# Altium project power_distribution.PrjPcb
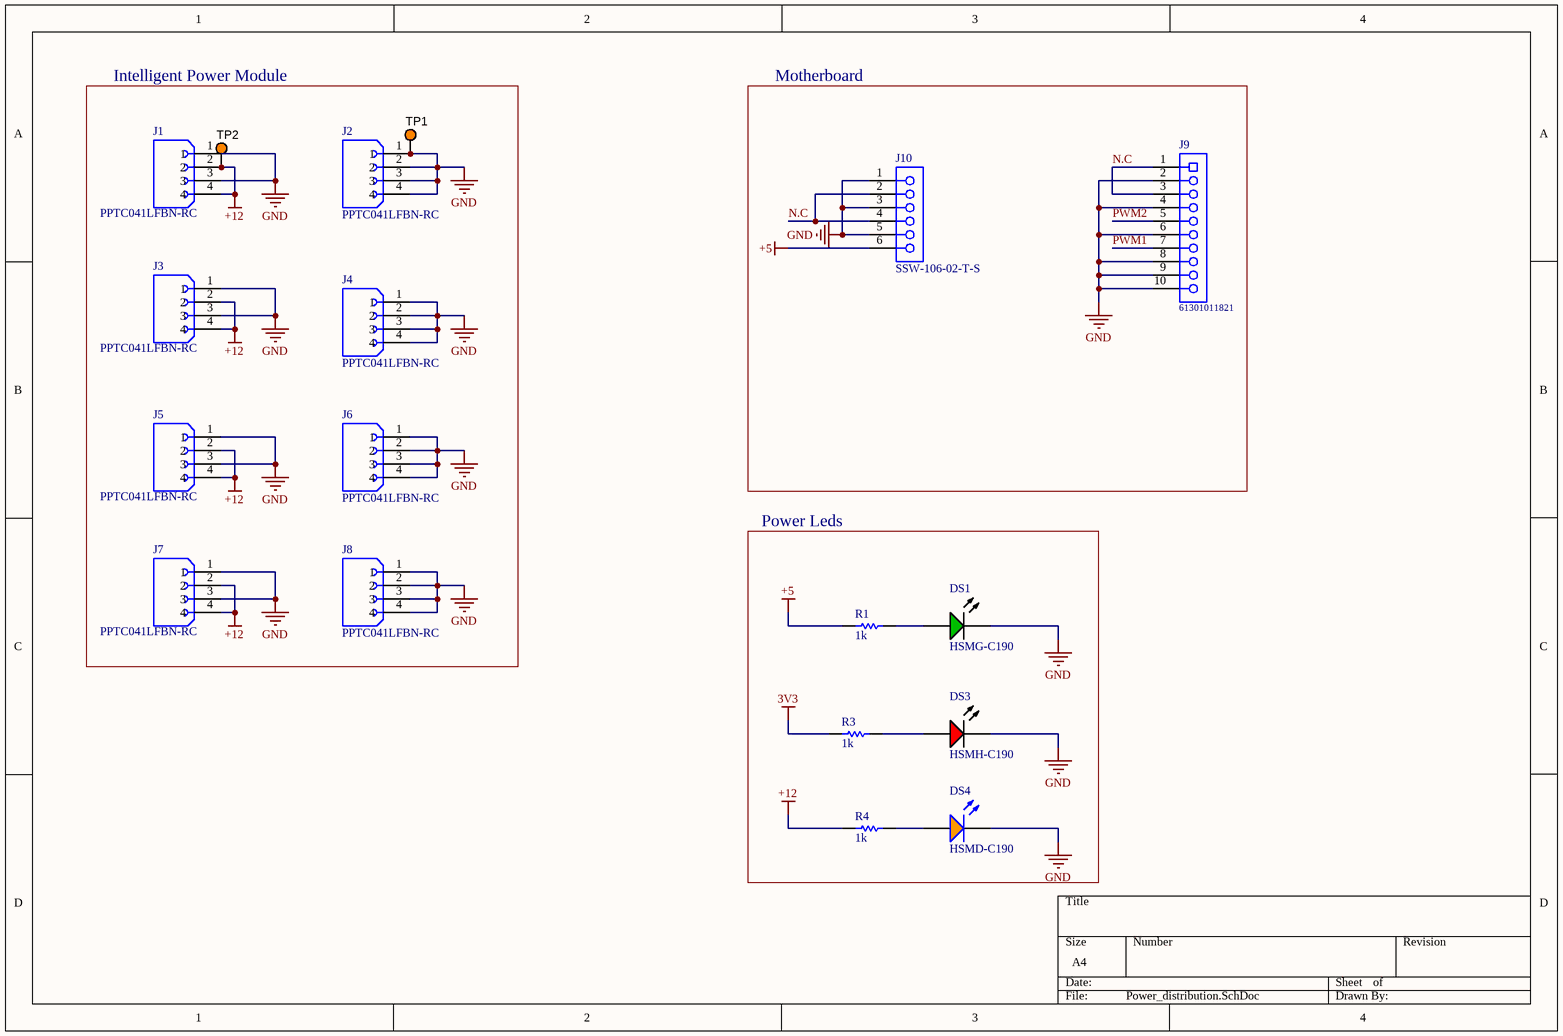
[diagram p0: Power_distribution.SchDoc]
2 sheets, 43 parts. Net scope: global (net labels, ports and power ports of the same name join across sheets).
Board file: Power_distribution.PcbDoc
Sheets:
  Power_distribution.SchDoc
  Power_distribution2.SchDoc

## Sheet Power_distribution.SchDoc
size A4; SheetNumber: 1; SheetTotal: 2

### Parts
DS1  HSMG-C190  [AVAG-HSMX-C190_V]
DS3  HSMH-C190  [AVAG-HSMX-C190_V]
DS4  HSMD-C190  [AVAG-HSMX-C190_V]
J1  PPTC041LFBN-RC  [SULLINS_PPTC041LFBN-RC]
J2  PPTC041LFBN-RC  [SULLINS_PPTC041LFBN-RC]
J3  PPTC041LFBN-RC  [SULLINS_PPTC041LFBN-RC]
J4  PPTC041LFBN-RC  [SULLINS_PPTC041LFBN-RC]
J5  PPTC041LFBN-RC  [SULLINS_PPTC041LFBN-RC]
J6  PPTC041LFBN-RC  [SULLINS_PPTC041LFBN-RC]
J7  PPTC041LFBN-RC  [SULLINS_PPTC041LFBN-RC]
J8  PPTC041LFBN-RC  [SULLINS_PPTC041LFBN-RC]
J9  61301011821  [61301011821]
J10  SSW-106-02-T-S  [SMTC-SSW-106-02-X-S]
R1  1k  [RESC1609X50X30NL8T20]
R3  1k  [RESC1609X50X30NL8T20]
R4  1k  [RESC1609X50X30NL8T20]
TP1  5003  [KSTN-5003]  (value not drawn)
TP2  5003  [KSTN-5003]  (value not drawn)

### Blocks framed on the sheet
Intelligent Power Module: J1-J8 TP1 TP2
Motherboard: J9 J10
Power Leds: DS1 DS3 DS4 R1 R3 R4

### Nets
3V3: R3.1
+5: J10.6 R1.1
+12: J1.2 J1.4 J3.2 J3.4 J5.2 J5.4 J7.2 J7.4 R4.1 TP2.1
GND: DS1.2(K) DS3.2(K) DS4.2(K) J1.1 J1.3 J2.1 J2.2 J2.3 J2.4 J3.1 J3.3 J4.1 J4.2 J4.3 J4.4 J5.1 J5.3 J6.1 J6.2 J6.3 J6.4 J7.1 J7.3 J8.1 J8.2 J8.3 J8.4 J9.2 J9.4 J9.6 J9.8 J9.9 J9.10 J10.1 J10.3 J10.5 TP1.1
N.C: J9.1 J9.3 J10.2 J10.4
PWM1: J9.7
PWM2: J9.5
NetDS1_1: DS1.1(A) R1.2
NetDS3_1: DS3.1(A) R3.2
NetDS4_1: DS4.1(A) R4.2

### Library data of the parts
DS1 = CMP-1744-00002-1: Chip LED, Green, 2.2 V, -40 to 85 degC, 2-Pin SMD, RoHS, Tape and Reel; Frequency: 400 KHz; Max Supply Voltage: 5.5 V; Access Time: 3500 ns; Clock Frequency: 100 KHz; Case\Package: SOIC; Density: 32 kb; Nominal Supply Current: 2 mA; Interface: Serial; Min Supply Voltage: 1.7 V; Packaging: Tape and Reel; PackageReference: HSMX-C190; ComponentLink2URL: http://docs.avagotech.com/docs/AV02-0551EN; RoHSCompliant: true; Pins: 8; REACH SVHC: No SVHC; Max Operating Temperature: 85 degC; Width: 4 mm; Radiation Hardening: No; Package Quantity: 3000; ComponentLink3Description: Package Specification; ComponentLink1Description: Manufacturer URL; Min Operating Temperature: -40 degC; PackageDescription: 2-Pin Surface Mount Device, Body 1.6 x 0.8 mm, Height 0.9 mm; Max Clock Frequency: 100 KHz; Height: 1.5 mm; ComponentLink1URL: http://www.avagotech.com/; DatasheetVersion: Mar-12; ComponentLink2Description: Datasheet; Mount: Surface Mount; Length: 5 mm; ComponentLink3URL: http://www.fairchildsemi.com/dwg/MA/MA03D.pdf
DS3 = CMP-1744-00004-1: LED Uni-Color Red, 65 mW, 20 mA, -40 to 85 degC, 2-Pin SMD, RoHS, Tape and Reel; Connector Type: USB; Gender: Male; Current Rating: 1 A; Length: 7.5 mm; Lead Pitch: 0.65 mm; PackageReference: HSMX-C190; Package Quantity: 2000; Max Operating Temperature: 85 degC; PackageDescription: 2-Pin Surface Mount Device, Body 1.6 x 0.8 mm, Height 0.9 mm; ComponentLink3Description: Package Specification; Mount: Surface Mount; Min Operating Temperature: -30 degC; ComponentLink3URL: http://www.fairchildsemi.com/dwg/MA/MA03D.pdf; ComponentLink1Description: Manufacturer URL; Contact Material: Copper; Pins: 5; Width: 5.6 mm; ComponentLink2Description: Datasheet; RoHSCompliant: true; DatasheetVersion: Mar-12; Height: 2.8 mm; Packaging: Tape and Reel; Contact Plating: Gold; ComponentLink1URL: http://www.avagotech.com/; REACH SVHC: No SVHC; ComponentLink2URL: http://docs.avagotech.com/docs/AV02-0551EN
DS4 = CMP-1744-00006-1: LED Uni-Color Orange, 52 mW, 20 mA, -40 to 85 degC, 2-Pin SMD, RoHS, Tape and Reel; ComponentLink2Description: Datasheet; RoHSCompliant: True; ComponentLink3URL: http://www.fairchildsemi.com/dwg/MA/MA03D.pdf; Package Quantity: 100; Max Operating Temperature: 225degC; Min Operating Temperature: -40degC; ComponentLink2URL: http://docs.avagotech.com/docs/AV02-0551EN; PackageDescription: 2-Pin Surface Mount Device, Body 1.6 x 0.8 mm, Height 0.9 mm; DatasheetVersion: Mar-12; PackageReference: HSMX-C190; ComponentLink1URL: http://www.avagotech.com/; ComponentLink3Description: Package Specification; ComponentLink1Description: Manufacturer URL
J1-J8 = PPTC041LFBN-RC: 4 Position Header Connector Through Hole; MF: Sullins Connector; MP: PPTC041LFBN-RC; Value: *; SnapEDA_Link: https://www.snapeda.com/parts/PPTC041LFBN-RC/Sullins%20Connector%20Solutions/view-part/285917/?ref=snap; Package: None; Availability: Warning; Check_prices: https://www.snapeda.com/parts/PPTC041LFBN-RC/Sullins%20Connector%20Solutions/view-part/285917/?ref=eda; Price: None; Purchase-URL: https://pricing.snapeda.com/search/part/PPTC041LFBN-RC/?ref=eda
J9 = CMP-1502-01332-1: THT Vertical Socket Header WR-PHD, Pitch 2.54 mm, Single Row, 10 pins; Manufacturer: Wurth Elektronik; Rated Current: 3A; Working Voltage: 250VAC; Gender: Female; Pitch: 2.54mm; Contact Resistance: 20mOhm; Pin Number: 10; Withstanding Voltage: 500VAC; Publisher: WurthElektronik; Orientation: Vertical; Row Number: Single; Package Reference: 61301011821; Packaging: Tray; Datasheet URL: https://katalog.we-online.de/em/datasheet/6130xx11821.pdf; Operating Temperature: -40to125degC; Part Number: 61301011821; Manufacturer URL: http://www.we-online.de; Mounting Technology: THT
J10 = CMP-1023-00360-1: SQ Post Socket, Through-hole, Vertical, -55 to 105 degC, 2.54mm Pitch, 6-Pin, Female, RoHS; Manufacturer: Samtec; ComponentLink1URL: http://www.samtec.com; Temperature Range: -55 to 105 degC; Pitch: 2.54 mm; Mounting Technology: Through-hole; DatasheetVersion: F-214; ComponentLink1Description: Manufacturer URL; PackageVersion: CA, 6/1987; ComponentLink3Description: Package Specification; PackageDescription: Assembly, Socket Strip .016 X .031 Tail; ComponentLink2Description: Datasheet; ComponentLink2URL: http://www.samtec.com/documents/webfiles/pdf/SSW_TH.PDF; PackageReference: SSW-106-02-X-S; ComponentLink3URL: http://www.samtec.com/documents/webfiles/cpdf/SSW-1XX-XX-XXX-X-XX-XXX-XX-MKT.pdf; RoHS: True; PartNumber: SSW-106-02-T-S; Orientation: Vertical
R1 R3 R4 = CMP-2000-03816-5: Chip Resistor, 0 Ohm, Jumper, 100 mW, -55 to 155 degC, 0603 (1608 Metric), RoHS, Tape and Reel; Manufacturer: Vishay Semiconductor; Voltage Rating: 75 V; Package Quantity: 5000; DatasheetVersion: 06/2012; Min Operating Temperature: -55 degC; ComponentLink1URL: http://www.vishay.com/; Mounting Technology: Surface Mount; Height: 0.45 mm; ComponentLink1Description: Manufacturer URL; REACH SVHC: Unknown; PackageReference: 0603; Packaging: Tape and Reel; Max Operating Temperature: 155 degC; Mount: Surface Mount; ComponentLink2Description: Datasheet; PackageDescription: 2-Pin Surface Mount Device, Body 1.575 x 0.85 mm; Length: 1.55 mm; ComponentLink2URL: http://www.vishay.com/docs/20035/dcrcwe3.pdf; Pins: 2; RoHSCompliant: true
TP1 TP2 = CMP-1672-00009-1: Test Point, Orange, 1-Pin THD, RoHS; Peak Reverse Current: 600 uA; Forward Current: 3 A; Max Surge Current: 80 A; Forward Voltage: 1.08 V; Max Operating Temperature: 150 degC; PackageReference: 5003; Pins: 2; ComponentLink2URL: http://keyelco.com/userAssets/file/M65p56.pdf; PackageDescription: 1-Pin Through Hole Device, Dia 2.54 mm; Weight: 0.01 lb; Diameter: 5.3 mm; Mount: Through Hole; Package Quantity: 500; Packaging: Bulk; Min Operating Temperature: -65 degC; ComponentLink1Description: Manufacturer URL; Height: 0.25 inch; ComponentLink1URL: http://www.keyelco.com/; ComponentLink2Description: Datasheet; Width: 0.25 inch; REACH SVHC: No SVHC; RoHSCompliant: true; Radiation Hardening: No; Length: 9.5 mm; DatasheetVersion: Jun-15

## Sheet Power_distribution2.SchDoc
size A4; SheetNumber: 2; SheetTotal: 2
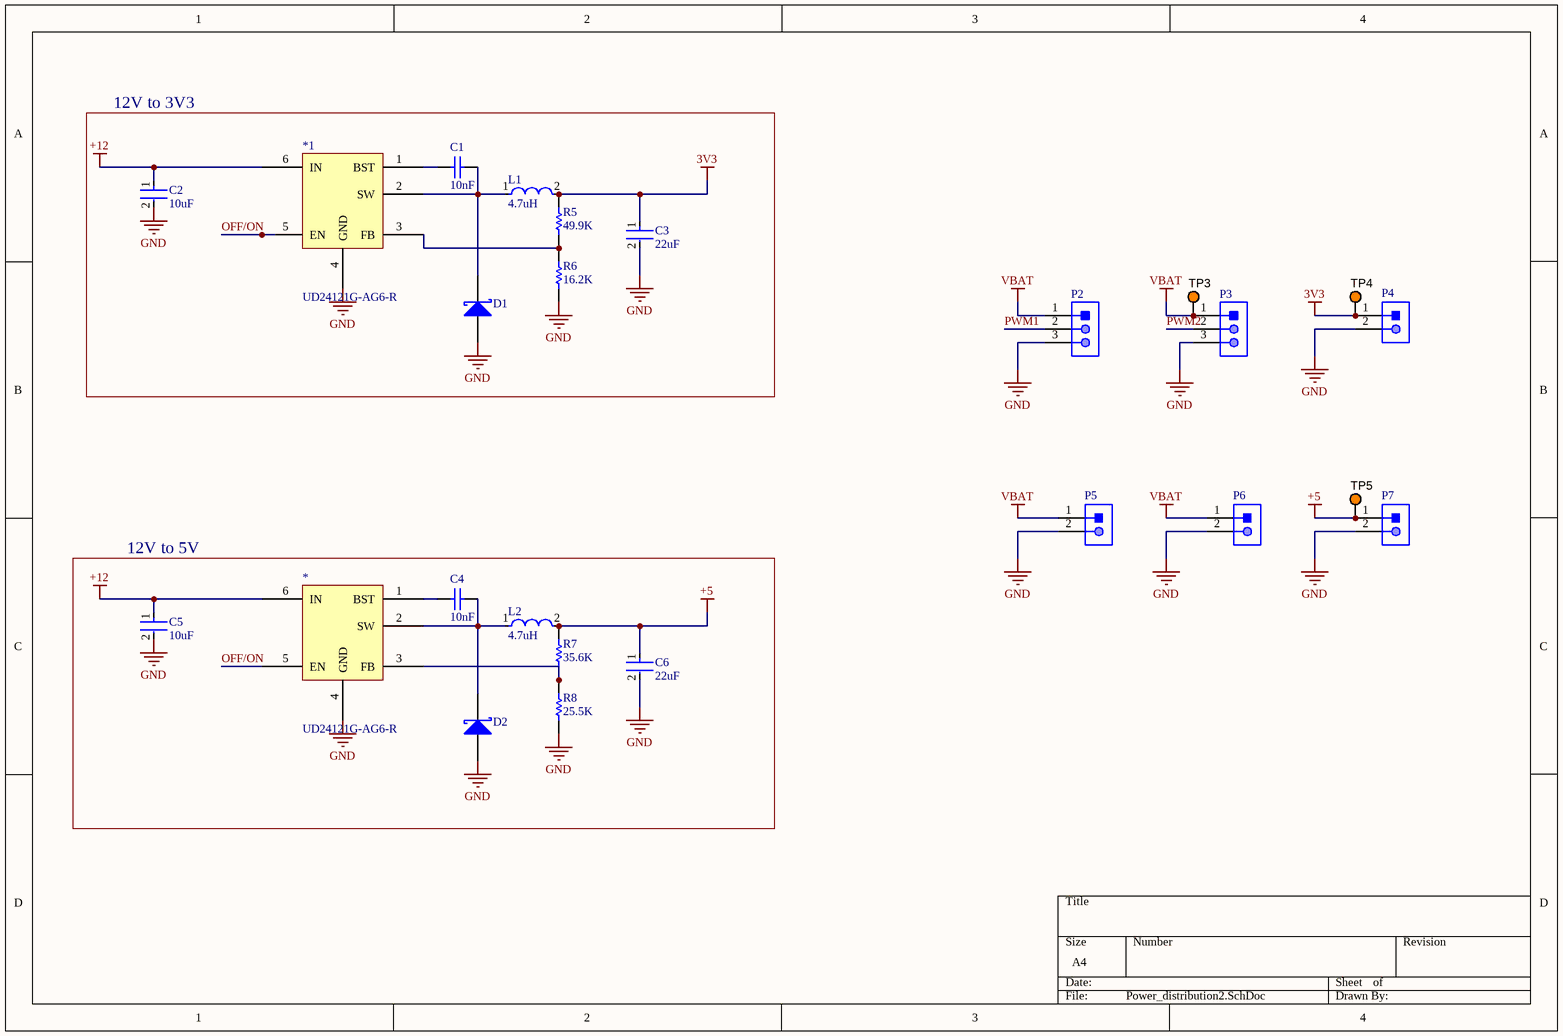
[diagram p1: Power_distribution2.SchDoc]

### Parts
*  UD24121G-AG6-R  [SOT95P245X110-6N]
*1  UD24121G-AG6-R  [SOT95P245X110-6N]
C1  10nF  [CAPC1608X90X35ML10T15]
C2  10uF  [FP-1210-L_3_3_0_4-W_2_5_0-MFG]
C3  22uF  [FP-GRM21B-0_15-MFG]
C4  10nF  [CAPC1608X90X35ML10T15]
C5  10uF  [FP-1210-L_3_3_0_4-W_2_5_0-MFG]
C6  22uF  [FP-GRM21B-0_15-MFG]
D1  B230A-13-F  [DIOD-SMA-2_V]  (value not drawn)
D2  B230A-13-F  [DIOD-SMA-2_V]  (value not drawn)
L1  4.7uH  [FP-LQH31CN_03-MFG]
L2  4.7uH  [FP-LQH31CN_03-MFG]
P2  B3B-PH-K-S(LF)(SN)  [JST-B3B-PH-K-S-3_V]  (value not drawn)
P3  B3B-PH-K-S(LF)(SN)  [JST-B3B-PH-K-S-3_V]  (value not drawn)
P4  S2B-PH-K-S(LF)(SN)  [JST-S2B-PH-K-S_V]  (value not drawn)
P5  S2B-PH-K-S(LF)(SN)  [JST-S2B-PH-K-S_V]  (value not drawn)
P6  S2B-PH-K-S(LF)(SN)  [JST-S2B-PH-K-S_V]  (value not drawn)
P7  S2B-PH-K-S(LF)(SN)  [JST-S2B-PH-K-S_V]  (value not drawn)
R5  49.9K  [RESC1005X40X25LL05T05]
R6  16.2K  [RESC2013X50X30NL20T20]
R7  35.6K  [RESC1005X40X25LL05T05]
R8  25.5K  [RESC2013X50X30NL20T20]
TP3  5003  [KSTN-5003]  (value not drawn)
TP4  5003  [KSTN-5003]  (value not drawn)
TP5  5003  [KSTN-5003]  (value not drawn)

### Blocks framed on the sheet
12V to 3V3: *1 C1-C3 D1 L1 R5 R6
12V to 5V: * C4-C6 D2 L2 R7 R8

### Nets
3V3: C3.1 L1.2 P4.1 R5.2 TP4.1
+5: C6.1 L2.2 P7.1 R7.2 TP5.1
+12: *.6(IN) *1.6(IN) C2.1 C5.1
GND: *.4(GND) *1.4(GND) C2.2 C3.2 C5.2 C6.2 D1.1(A) D2.1(A) P2.3 P3.3 P4.2 P5.2 P6.2 P7.2 R6.1 R8.1
VBAT: P2.1 P3.1 P5.1 P6.1 TP3.1
OFF/ON: *.5(EN) *1.5(EN)
PWM1: P2.2
PWM2: P3.2
Net*1_1: *1.1(BST) C1.1
Net*1_2: *1.2(SW) C1.2 D1.2(K) L1.1
Net*1_3: *1.3(FB) R5.1 R6.2
Net*_1: *.1(BST) C4.1
Net*_2: *.2(SW) C4.2 D2.2(K) L2.1
Net*_3: *.3(FB) R7.1 R8.2

### Library data of the parts
C1 C4 = CMP-2100-03642-1: Chip Capacitor, 10 nF, +/- 10%, 50 V, -55 to 125 degC, 0603 (1608 Metric), RoHS, Tape and Reel; Manufacturer: Murata; Insulation Resistance: 10GR; Dielectric: X7R; Voltage Rating: 50V; Material: Ceramic; Package Quantity: 1; Lead Free: LeadFree; Case/Package: 0603; Termination: SMD/SMT; REACH SVHC: Unknown; Manufacturer URL: http://www.murata.com/; Datasheet URL: http://search.murata.co.jp/Ceramy/image/img/A01X/G101/ENG/GRM188R71H103KA01-01.pdf; Mount: SurfaceMount; Datasheet Version: 42401.0; Number of Pins: 2; Length: 1.6mm; Voltage: 50V; Depth: 0.8mm; Tolerance: 10%; Min Operating Temperature: -55degC; Voltage Rating (DC): 50V; Max Operating Temperature: 125degC; Package Description: 2-Pin Surface Mount Device, Body 1.6 x 0.8 mm; RoHSCompliant: True; Case Code (Imperial): 0603; Width: 0.031inch; Case Code (Metric): 1608; Height: 0.8mm; Package Reference: 0603; Packaging: TapeandReel; Thickness: 0.035inch; Capacitance: 10nF; Dielectric Material: Ceramic
C2 C5 = CMP-2000-05477-2: General Purpose Ceramic Capacitor, 1210, 10uF, 10%, X5R, 15%, 25V; Lead Free: Lead Free; Max Operating Temperature: 85°C; REACH SVHC: No SVHC; Depth: 2.5mm; Packaging: Tape and Reel; Min Operating Temperature: -55°C; Height: 2.29mm; Construction: Flat; Case Code (Imperial): 1210; Radiation Hardening: No; Voltage: 25V; Case/Package: 1210; Series: -; Dielectric: X5R; Length: 3.2mm; Thickness: 0.11inch; Package Quantity: 1; Termination: SMD/SMT; Case Code (Metric): 3225; Voltage Rating (DC): 25V; Voltage Rating: 25V; Contact Plating: Tin; RoHS Compliant: Yes; Mount: Surface Mount; Width: 0.098inch; Capacitance: 10uF; Tolerance: 10%
C3 C6 = CMP-2007-03385-2: Chip Multilayer Ceramic Capacitors for General Purpose, 0805, 22uF, X5R, 15%, 20%, 6.3V; Material: Ceramic; Max Operating Temperature: 85°C; Voltage: 6.3V; Min Operating Temperature: -55°C; Case/Package: 0805; Thickness: 0.053inch; Dielectric: X5R; Packaging: Tape and Reel; Depth: 1.25mm; Termination: SMD/SMT; Voltage Rating (DC): 6.3V; Radiation Hardening: No; Tolerance: 20%; Mount: Surface Mount; Lead Free: Lead Free; Package Quantity: 1; REACH SVHC: No SVHC; Voltage Rating: 6.3V; Capacitance: 22uF; Length: 2mm; Case Code (Imperial): 0805; Case Code (Metric): 2012; Width: 0.049inch; Height: 1.25mm
D1 D2 = CMP-0905-00001-1: 2 A Surface Mount Schottky Barrier Rectifier, 30 V, -65 to 150 degC, 2-Pin SMA, RoHS, Tape and Reel; Manufacturer: Diodes Inc; VRRM: 30 V; IO: 2 A Max.; CT: 200 pF; IFSM: 50 A; VF: 0.5 V; IF: 2 A; ComponentLink1Description: Manufacturer URL; PackageDescription: 2-Pin SMA, Body 4.3 x 2.605 mm, Height 2.3 mm; Mounting Technology: Surface Mount; ComponentLink1URL: http://diodes.com/; VR: 30 V; PackageReference: SMA-2; RoHS: TRUE; ComponentLink2URL: http://diodes.com/datasheets/ds13004.pdf; Packing: Tape and Reel; DatasheetVersion: Rev. 21 - 2; ComponentLink2Description: Datasheet; Temperature Range: -65 to 150 degC; PartNumber: B230A-13-F
L1 L2 = CMP-06042-006664-1: Wire Wound Ferrite Inductor for General Circuits 4.7μH ±10% 2.21Ω 120mA 1206; Self Resonant Frequency: 31MHz; Current: 105mA; Test Frequency: 1MHz; Shielding: Unshielded; DC Resistance (DCR): 1.7R; Q Factor: 35; Length: 0.125inch; Package Quantity: 1; REACH SVHC: No SVHC; Weight: 0.001023oz; Inductance Tolerance: 10%; Case Code (Metric): 3216; Max Operating Temperature: 85°C; Case/Package: 1206; Inductance: 4.7uH; Radiation Hardening: No; Tolerance: 10%; Packaging: Tape and Reel; Military Standard: Not; Lead Free: Lead Free; Core Material: Ferrite; Min Operating Temperature: -25°C; Mount: Surface Mount; Current Rating: 120mA; Height: 1.8mm; Case Code (Imperial): 1206; Depth: 1.8mm; DC Current: 120mA; Max DC Current: 120mA; Width: 1.6mm; Termination: SMD/SMT
P2 P3 = CMP-2000-05164-1: Male Header, Pitch 2 mm, 1 x 3 Position, Height 6 mm, Tail Length 3.4 mm, -25 to 85 degC, RoHS, Bulk; Manufacturer: JST; Style/Orientation: StraightHeader/Plug; Pitch: 2mm; No of Positions: 3; Termination: Crimp; Manufacturer URL: http://www.jst.com/home2.html; Datasheet Version: Oct-06; Type: ShroudedHeader; Datasheet URL: https://datasheet.ciiva.com/11746/0900766b80826550-11746939.pdf
P4-P7 = CMP-1755-00004-1: Male Header, Pitch 2 mm, 1 x 2 Position, Height 4.8 mm, Tail Length 3.4 mm, -25 to 85 degC, RoHS, Bulk; Case\Package: Radial; Tolerance: 20%; Capacitance: 10 uF; Voltage Rating (DC): 50 V; Packaging: Bulk; ComponentLink1URL: http://www.jst-mfg.com/product/pdf/eng/ePH.pdf; Radiation Hardening: No; Height: 11 mm; Package Quantity: 200; PackageDescription: Male Header, Pitch 2 mm, 1 x 2 Position, Height 4.8 mm, Tail Length 3.4 mm; PackageReference: S2B-PH-K-S; Diameter: 5 mm; Pins: 2; Mount: Through Hole; Max Operating Temperature: 85 degC; Min Operating Temperature: -40 degC; ComponentLink1Description: Datasheet; DatasheetVersion: Dec-12; Length: 11 mm; Lead Pitch: 2 mm; REACH SVHC: No SVHC; Voltage Rating: 50 V; RoHSCompliant: true
R5 R7 = CMP-2002-00967-3: Chip Resistor, 49.9 KOhm, +/- 1%, 100 mW, -55 to 155 degC, 0402 (1005 Metric), RoHS, Tape and Reel; Manufacturer: Basic Passives; PartNumber: ERJ-2RKF4992X; Case\/Package: 0402; Power Rating: 100 mW; Voltage Rating: 50 V; Pins: 2; Case Code (Imperial): 0402; Package Quantity: 10000; REACH SVHC: No SVHC; DatasheetVersion: 04/2015; Width: 0.5 mm; Height: 0.35 mm; Case Code (Metric): 1005; ComponentLink2URL: http://industrial.panasonic.com/cdbs/www-data/pdf/RDA0000/AOA0000C86.pdf; Mounting Technology: Surface Mount; ComponentLink1Description: Manufacturer URL; Resistance: 49.9 KOhm; PackageDescription: 2-Pin Surface Mount Device, Body 1 x 0.5 mm; Radiation Hardening: No; RoHSCompliant: true; PackageReference: 0402; Max Operating Temperature: 155 degC; Packaging: Tape and Reel; Mount: Surface Mount; Tolerance: 1%; Min Operating Temperature: -55 degC; ComponentLink1URL: http://www.panasonic.com/; ComponentLink2Description: Datasheet; Length: 1 mm
R6 R8 = CMP-1013-00645-2: Part Number: CRCW080516K2FKEA; Manufacturer: Vishay Dale
TP3-TP5 = CMP-1672-00009-1: as TP1 on sheet Power_distribution; Max Operating Temperature: 150 degC; PackageReference: 5003; Pins: 2; ComponentLink2URL: http://keyelco.com/userAssets/file/M65p56.pdf; PackageDescription: 1-Pin Through Hole Device, Dia 2.54 mm; Weight: 0.01 lb; Diameter: 5.3 mm; Mount: Through Hole; Package Quantity: 500; Packaging: Bulk; Min Operating Temperature: -65 degC; ComponentLink1Description: Manufacturer URL; Height: 0.25 inch; ComponentLink1URL: http://www.keyelco.com/; ComponentLink2Description: Datasheet; Width: 0.25 inch; REACH SVHC: No SVHC; RoHSCompliant: true; Radiation Hardening: No; Length: 9.5 mm; DatasheetVersion: Jun-15

## Nets that join several sheets
3V3: Power_distribution (R3.1), Power_distribution2 (5 pins)
+5: Power_distribution (J10.6 R1.1), Power_distribution2 (5 pins)
+12: Power_distribution (10 pins), Power_distribution2 (*.6 *1.6 C2.1 C5.1)
GND: Power_distribution (37 pins), Power_distribution2 (16 pins)
PWM1: Power_distribution (J9.7), Power_distribution2 (P2.2)
PWM2: Power_distribution (J9.5), Power_distribution2 (P3.2)